# EAGLE design 307_ble (EAGLE 7.4.0)
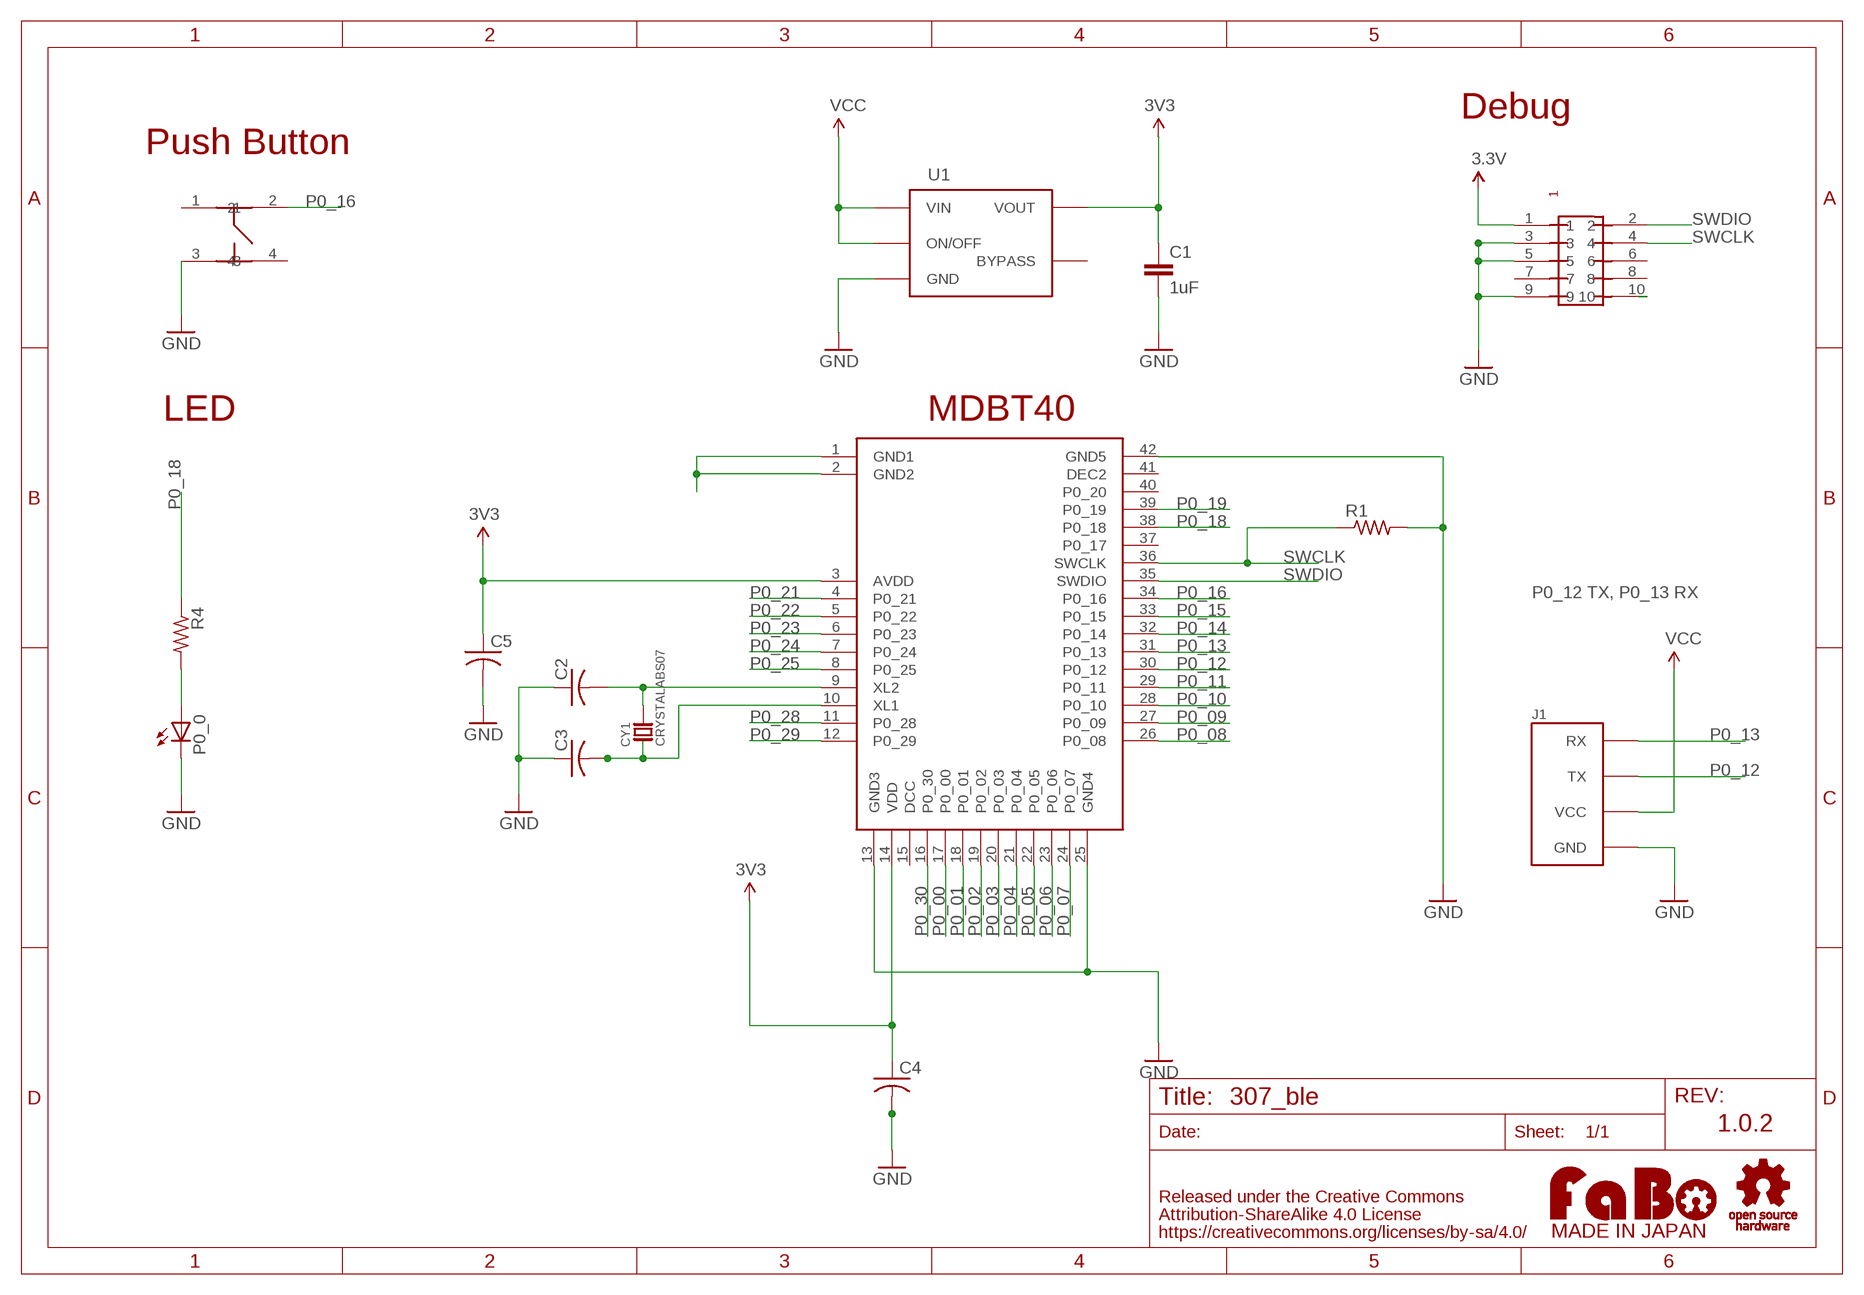
[diagram p0: schematic, sheet 1]

## Parts
C1  1uF  CAP-EIA0603  [EIA0603]
C2  C-USC0603  [C0603]
C3  C-USC0603  [C0603]
C4  C-USC0603  [C0603]
C5  C-USC0603  [C0603]
CY1  CRYSTALABS07  [ABRACOM-ABS07-32.768KHZ]
J1  FABO_BRICK_SERIAL  [FABO_BRICK_SERIAL]
P0_0  LEDCHIP-LED0603  [CHIP-LED0603]
R1  R-US_R0603  [R0603]
R4  R-US_R0603  [R0603]
U1  LP2985-33DBVR  [SOT_23_5]
U$2  LOGO_OSHW-T_M_BOTTOM  [LOGO_OSHW_T_M_BOTTOM]
U$3  LOGO_FABO-M_BOTTOM  [LOGO_FABO_M_BOTTOM]
U$6  SWICTH-4P(KMR2)  [SWITCH-4P(KMR2)]
U$7  RAYTAC-MDBT40  [RAYTAC-MDBT40]
U$8  PIN-HEADER-SMT(1.27MM)2X5  [PIN-HEADER-SMT(1.27MM)2X5]

## Nets
3.3V: U$8.1
3V3: C1.1 C4.1 C5.1 U1.5(VOUT) U$7.3(AVDD) U$7.14(VDD)
GND: C1.2 C2.1 C3.1 C4.2 C5.2 J1.GND P0_0.C R1.2 U1.2(GND) U$6.3 U$7.13(GND3) U$7.25(GND4) U$7.42(GND5) U$8.3 U$8.5 U$8.9
N$3: P0_0.A R4.2
N$7: C2.2 CY1.P$2 U$7.9(XL2)
N$8: C3.2 CY1.P$1 U$7.10(XL1)
N$10: U$7.1(GND1) U$7.2(GND2)
P0_00: U$7.17(P0_00)
P0_01: U$7.18(P0_01)
P0_02: U$7.19(P0_02)
P0_03: U$7.20(P0_03)
P0_04: U$7.21(P0_04)
P0_05: U$7.22(P0_05)
P0_06: U$7.23(P0_06)
P0_07: U$7.24(P0_07)
P0_08: U$7.26(P0_08)
P0_09: U$7.27(P0_09)
P0_10: U$7.28(P0_10)
P0_11: U$7.29(P0_11)
P0_12: J1.TX U$7.30(P0_12)
P0_13: J1.RX U$7.31(P0_13)
P0_14: U$7.32(P0_14)
P0_15: U$7.33(P0_15)
P0_16: U$6.2 U$7.34(P0_16)
P0_18: R4.1 U$7.38(P0_18)
P0_19: U$7.39(P0_19)
P0_21: U$7.4(P0_21)
P0_22: U$7.5(P0_22)
P0_23: U$7.6(P0_23)
P0_24: U$7.7(P0_24)
P0_25: U$7.8(P0_25)
P0_28: U$7.11(P0_28)
P0_29: U$7.12(P0_29)
P0_30: U$7.16(P0_30)
RESET: U$8.10
SWCLK: R1.1 U$7.36(SWCLK) U$8.4
SWDIO: U$7.35(SWDIO) U$8.2
VCC: J1.VCC U1.1(VIN) U1.3(ON/OFF)
Unconnected: U1.4(BYPASS) U$6.1 U$6.4 U$7.15(DCC) U$7.37(P0_17) U$7.40(P0_20) U$7.41(DEC2) U$8.6 U$8.7 U$8.8

## Notes on the sheet
- Debug
- Push Button
- LED | MDBT40
- P0_12 TX, P0_13 RX
- 1.0.2

## Library data of the parts
C1 = FaBo-etc:CAP: Capacitor Standard 0603 ceramic capacitor
C2-C5 = adafruit:C-US: CAPACITOR, American symbol
CY1 = FaBo-Crystal:CRYSTAL
J1 = FaBo-Template:FABO_BRICK_SERIAL: FaBo Brick Serial
P0_0 = led:LED: LED OSRAM: - CHIPLED LG R971, LG N971, LY N971, LG Q971, LY Q971, LO R971, LY R971 LH N974, LH R974 LS Q976, LO Q976, LY Q976 LO Q996 - Hyper CHIPLED LW Q18S LB Q993, LB Q99A, LB R99A - SideLED LS A670, LO A670, LY A670, LG A670, LP A670 LB A673, LV A673, LT A673, LW A673 LH A674 LY A675 LS A676, LA A676, LO A676, LY A676, LW A676 LS A679, LY A679, LG A679 - Hyper Micro SIDELED® LS Y876, LA Y876, LO Y876, LY Y876 LT Y87S - SmartLED LW L88C, LW L88S LB L89C, LB L89S, LG L890 LS L89K, LO L89K, LY L89K LS L896, LA L896, LO L896, LY L896 - TOPLED LS T670, LO T670, LY T670, LG T670, LP T670 LSG T670, LSP T670, LSY T670, LOP T670, LYG T670 LG T671, LOG T671, LSG T671 LB T673, LV T673, LT T673, LW T673 LH T674 LS T676, LA T676, LO T676, LY T676, LB T676, LH T676, LSB T676, LW T676 LB T67C, LV T67C, LT T67C, LS T67K, LO T67K, LY T67K, LW E67C LS E67B, LA E67B, LO E67B, LY E67B, LB E67C, LV E67C, LT E67C LW T67C LS T679, LY T679, LG T679 LS T770, LO T770, LY T770, LG T770, LP T770 LB T773, LV T773, LT T773, LW T773 LH T774 LS E675, LA E675, LY E675, LS T675 LS T776, LA T776, LO T776, LY T776, LB T776 LHGB T686 LT T68C, LB T68C - Hyper Mini TOPLED® LB M676 - Mini TOPLED Santana® LG M470 LS M47K, LO M47K, LY M47K Source: http://www.osram.convergy.de LUXEON: - LUMILED® LXK2-PW12-R00, LXK2-PW12-S00, LXK2-PW14-U00, LXK2-PW14-V00 LXK2-PM12-R00, LXK2-PM12-S00, LXK2-PM14-U00 LXK2-PE12-Q00, LXK2-PE12-R00, LXK2-PE12-S00, LXK2-PE14-T00, LXK2-PE14-U00 LXK2-PB12-K00, LXK2-PB12-L00, LXK2-PB12-M00, LXK2-PB14-N00, LXK2-PB14-P00, LXK2-PB14-Q00 LXK2-PR12-L00, LXK2-PR12-M00, LXK2-PR14-Q00, LXK2-PR14-R00 LXK2-PD12-Q00, LXK2-PD12-R00, LXK2-PD12-S00 LXK2-PH12-R00, LXK2-PH12-S00 LXK2-PL12-P00, LXK2-PL12-Q00, LXK2-PL12-R00 Source: www.luxeon.com KINGBRIGHT: KA-3528ASYC Source: www.kingbright.com
R1 R4 = adafruit:R-US_: RESISTOR, American symbol
U1 = FaBo-Supply:LP2985: LP2985 IC REG LDO 3.3V 0.15 A
U$2 = FaBo-etc:LOGO_OSHW
U$3 = FaBo-etc:LOGO_FABO
U$6 = gclue-test:SWICTH-4P(KMR2)
U$7 = FaBo-BT:RAYTAC-MDBT40
U$8 = GClue:PIN-HEADER-SMT(1.27MM)2X5: PIN-HEADER-SMT (1.27MM) 2x5

## Board
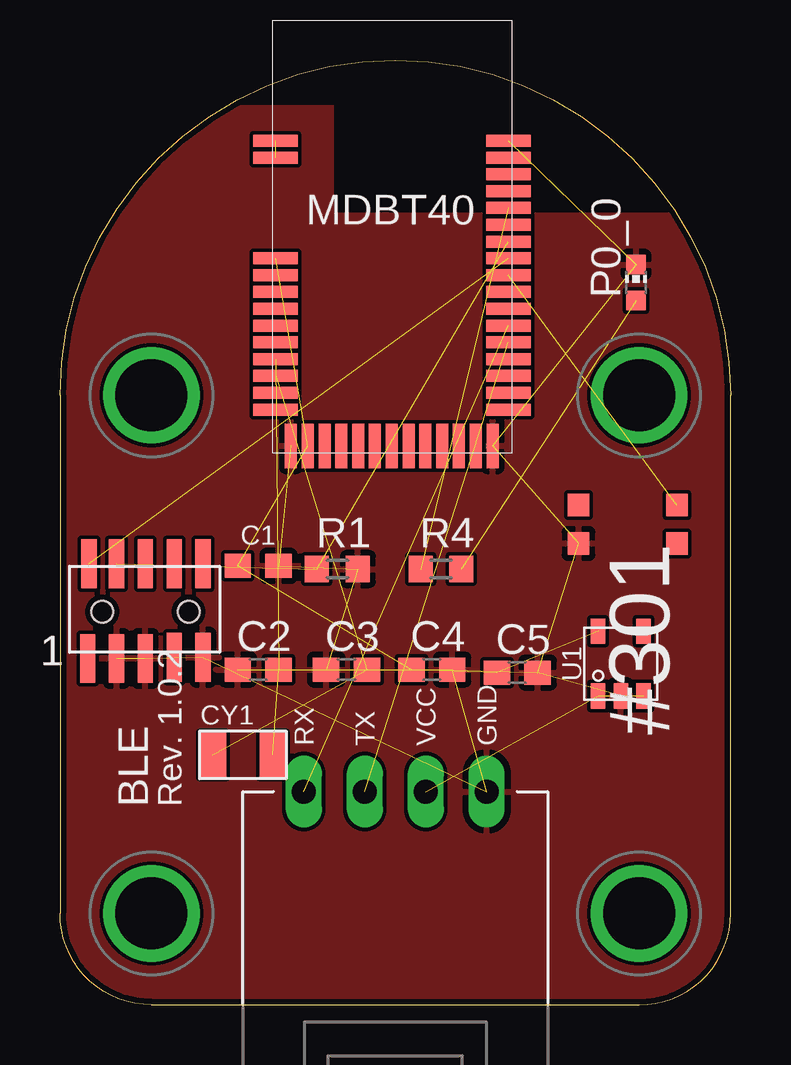
[diagram p1: board, top side]
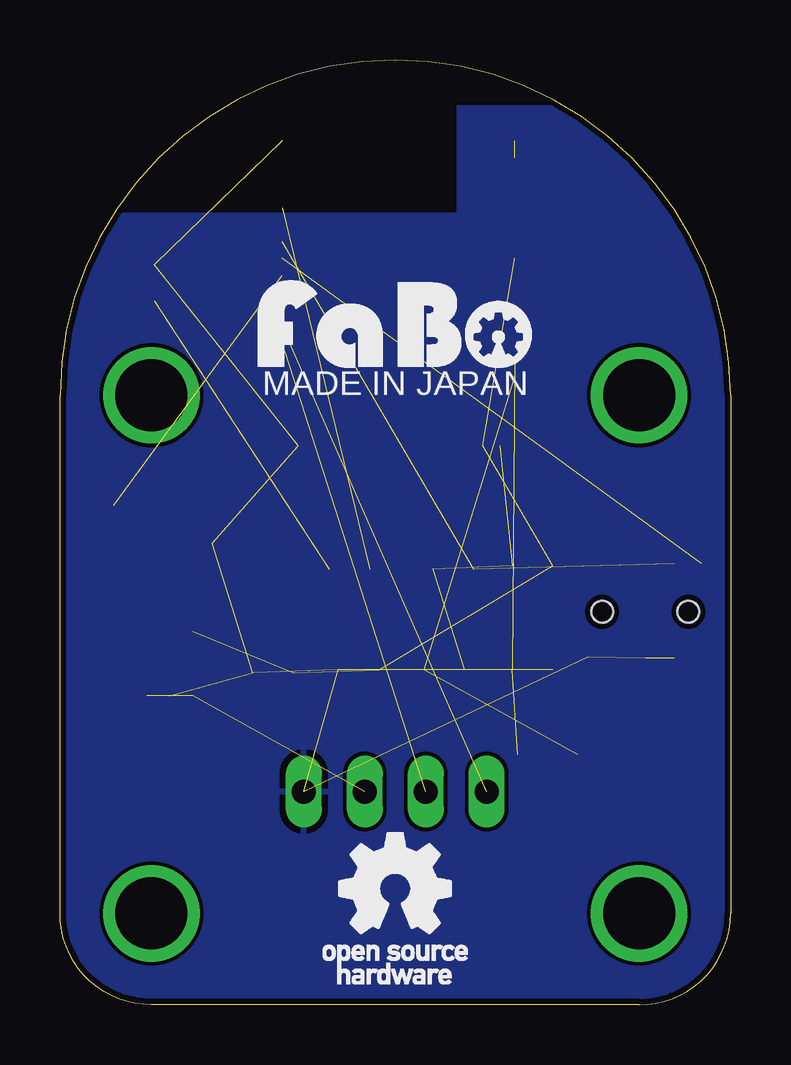
[diagram p2: board, bottom side, seen from below]

Size 27.94 x 39.37 mm. Coordinates in mm from the lower left corner, seen from the top.
Copper layers (1*16): Top 0.035mm / dielectric 1.5mm / Bottom 0.035mm
Design rules "Elecrow_2-layer_eagle_rule": minimum track width 6mil, minimum drill 12mil, track to track 6mil, track to pad 6mil, pad to pad 6mil, via to via 6mil, smd to smd 0mil, copper to edge 10mil, drill to drill 10mil, minimum pad ring 10mil, minimum via ring 6mil, stop-mask expansion 2mil, vias tented up to drill 100mil, thermal gap 10mil
tRestrict: area 11.4,33 to 29.2,40.6
bRestrict: area 11.4,33 to 29.2,40.6

### Footprints (pad centres in the part's own frame; a part is rotated, then mirrored left to right if it is on the bottom)
EIA0603 = smd 1.1 x 1: 1 -0.85,0; 2 0.85,0
C0603 = smd 1.1 x 1: 1 -0.85,0; 2 0.85,0
ABRACOM-ABS07-32.768KHZ = smd 1.1 x 1.9: P$1 -1.25,0; P$2 1.25,0
FABO_BRICK_SERIAL = drill 1 long: GND 3.81,-10.16; RX -3.81,-10.16; TX -1.27,-10.16; VCC 1.27,-10.16 | drill 3 pad 3.81: P$5 -10.16,6.35; P$6 10.16,6.35; P$7 -10.16,-15.24; P$8 10.16,-15.24
CHIP-LED0603 = smd 0.8 x 0.8: A 0,-0.75; C 0,0.75
R0603 = smd 1 x 1.1: 1 -0.85,0; 2 0.85,0
SOT_23_5 = smd 0.6 x 1.05: 1 -0.95,-1.35; 2 0,-1.35; 3 0.95,-1.35; 4 0.95,1.35; 5 -0.95,1.35
SWITCH-4P(KMR2) = smd 0.9 x 0.95: 1 -1,0; 2 3.1,0; 3 -1,-1.6; 4 3.1,-1.6
RAYTAC-MDBT40 = smd 1.85 x 0.5: 1 -4.86,4; 2 -4.86,3.3; 3 -4.86,-0.9; 4 -4.86,-1.6; 5 -4.86,-2.3; 6 -4.86,-3; 7 -4.86,-3.7; 8 -4.86,-4.4; 9 -4.86,-5.1; 10 -4.86,-5.8; 11 -4.86,-6.5; 12 -4.86,-7.2; 26 4.84,-7.2; 27 4.84,-6.5; 28 4.84,-5.8; 29 4.84,-5.1; 30 4.84,-4.4; 31 4.84,-3.7; 32 4.84,-3; 33 4.84,-2.3; 34 4.84,-1.6; 35 4.84,-0.9; 36 4.84,-0.2; 37 4.84,0.5; 38 4.84,1.2; 39 4.84,1.9; 40 4.84,2.6; 41 4.84,3.3; 42 4.84,4 | smd 0.5 x 1.85: 13 -4.22,-8.71; 14 -3.52,-8.71; 15 -2.82,-8.71; 16 -2.12,-8.71; 17 -1.42,-8.71; 18 -0.72,-8.71; 19 -0.02,-8.71; 20 0.68,-8.71; 21 1.38,-8.71; 22 2.08,-8.71; 23 2.78,-8.71; 24 3.48,-8.71; 25 4.18,-8.71
PIN-HEADER-SMT(1.27MM)2X5 = smd 0.635 x 2.032: 1 -2.4,-1.95; 2 -2.35,2; 3 -1.2,-1.95; 4 -1.2,2; 5 0,-1.95; 6 0,2; 7 1.2,-1.9; 8 1.2,2; 9 2.4,-1.9; 10 2.4,2 | hole 0.9: 1.8,0; -1.8,0

### Placement (x,y rotation side)
C1  8.26,18.29 0 top
C2  8.26,13.97 0 top
C3  11.94,13.97 0 top
C4  15.49,13.97 0 top
C5  19.05,13.84 0 top
CY1  7.62,10.41 0 top
J1  13.97,19.05 0 top
P0_0  24,30.1 0 top
R1  11.56,18.16 0 top
R4  15.88,18.16 0 top
U1  23.37,14.22 0 top
U$2  13.97,4.83 0 top
U$3  13.97,26.54 0 top
U$6  22.61,20.83 0 top
U$7  13.84,32 0 top
U$8  3.56,16.38 0 top

### Tracks (layer width: path | path; a pad name or v marks a point on that pad's centre or on a via)
3V3  (5 unrouted)
GND  (15 unrouted)
  pour Bottom: -1.27,-1.27 29.21,-1.27 29.21,40.64 -1.27,40.64
  pour Top: -1.27,-1.27 29.21,-1.27 29.21,40.64 -1.27,40.64
N$3  (1 unrouted)
N$7  (2 unrouted)
N$8  (2 unrouted)
N$10  (1 unrouted)
P0_12  (1 unrouted)
P0_13  (1 unrouted)
P0_16  (1 unrouted)
P0_18  (1 unrouted)
SWCLK  (2 unrouted)
SWDIO  (1 unrouted)
VCC  (2 unrouted)

### Text on the board
tPlace: #301 | BLE | Rev. 1.0.2
bPlace: MADE IN JAPAN